# EAGLE design brain (EAGLE 7.5.0)
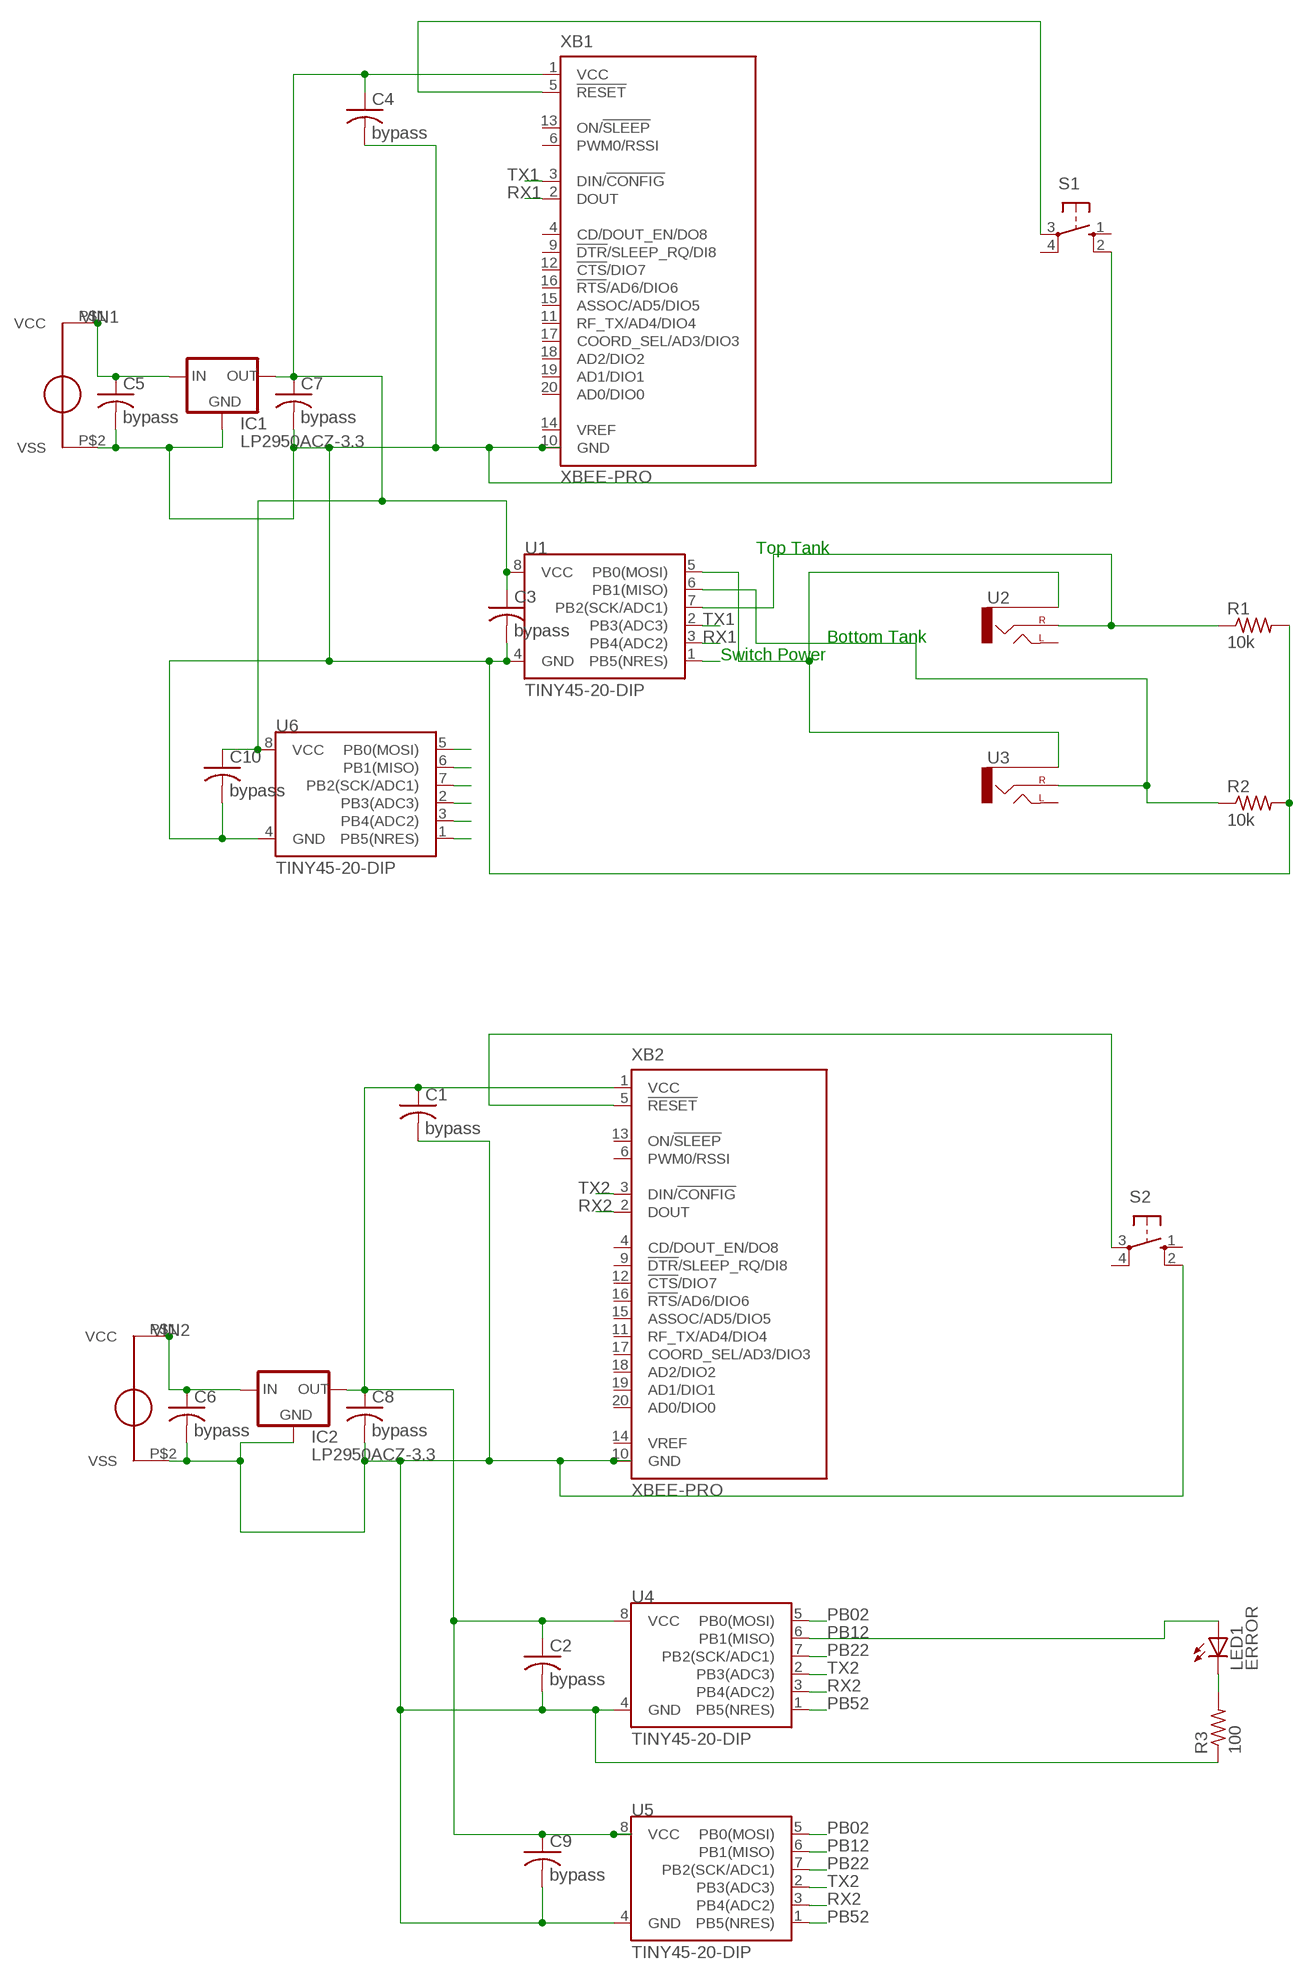
[diagram p0: schematic, sheet 1]

## Parts
C1  bypass  C-US050-025X075  [C050-025X075]
C2  bypass  C-US050-025X075  [C050-025X075]
C3  bypass  C-US050-025X075  [C050-025X075]
C4  bypass  C-US050-025X075  [C050-025X075]
C5  bypass  C-US050-025X075  [C050-025X075]
C6  bypass  C-US050-025X075  [C050-025X075]
C7  bypass  C-US050-025X075  [C050-025X075]
C8  bypass  C-US050-025X075  [C050-025X075]
C9  bypass  C-US050-025X075  [C050-025X075]
C10  bypass  C-US050-025X075  [C050-025X075]
IC1  LP2950ACZ-3.3  [TO92]
IC2  LP2950ACZ-3.3  [TO92]
LED1  ERROR  LED3MM  [LED3MM]
R1  10k  R-US_0207/10  [0207/10]
R2  10k  R-US_0207/10  [0207/10]
R3  100  R-US_0207/10  [0207/10]
S1  10-XX  [B3F-10XX]
S2  10-XX  [B3F-10XX]
U1  TINY45-20-DIP  ATTINY45TINY45-20-DIP  [DIP08]
U2  AUDIO-JACKPTH  [AUDIO-JACK]
U3  AUDIO-JACKPTH  [AUDIO-JACK]
U4  TINY45-20-DIP  ATTINY45TINY45-20-DIP  [DIP08]
U5  TINY45-20-DIP  ATTINY45TINY45-20-DIP  [DIP08]
U6  TINY45-20-DIP  ATTINY45TINY45-20-DIP  [DIP08]
U$3  SUNNYBUDDYMOUNT  [SUNNYBUDDYMOUNT]
U$6  SUNNYBUDDYMOUNT  [SUNNYBUDDYMOUNT]
XB1  XBEE-PRO  [XBEE-PRO]
XB2  XBEE-PRO  [XBEE-PRO]

## Nets
GND1: C3.2 C4.2 C5.2 C7.2 C10.2 IC1.2(GND) R1.2 R2.2 S1.2(S1) U1.4(GND) U6.4(GND) U$3.P$2(VSS) XB1.10(GND)
GND2: C1.2 C2.2 C6.2 C8.2 C9.2 IC2.2(GND) R3.1 S2.2(S1) U4.4(GND) U5.4(GND) U$6.P$2(VSS) XB2.10(GND)
N$5: LED1.K(C) R3.2
N$8: S2.3(P) XB2.5(!RESET)
N$13: S1.3(P) XB1.5(!RESET)
PB01: U1.5(PB0(MOSI)) U2.SLEEVE U3.SLEEVE U6.5(PB0(MOSI))
PB02: U4.5(PB0(MOSI)) U5.5(PB0(MOSI))
PB11: R2.1 U1.6(PB1(MISO)) U3.RING(RIGHT) U6.6(PB1(MISO))
PB12: LED1.A U4.6(PB1(MISO)) U5.6(PB1(MISO))
PB21: R1.1 U1.7(PB2(SCK/ADC1)) U2.RING(RIGHT) U6.7(PB2(SCK/ADC1))
PB22: U4.7(PB2(SCK/ADC1)) U5.7(PB2(SCK/ADC1))
PB51: U1.1(PB5(NRES)) U6.1(PB5(NRES))
PB52: U4.1(PB5(NRES)) U5.1(PB5(NRES))
RX1: U1.3(PB4(ADC2)) U6.3(PB4(ADC2)) XB1.2(DOUT)
RX2: U4.3(PB4(ADC2)) U5.3(PB4(ADC2)) XB2.2(DOUT)
TX1: U1.2(PB3(ADC3)) U6.2(PB3(ADC3)) XB1.3(DIN/!CONFIG)
TX2: U4.2(PB3(ADC3)) U5.2(PB3(ADC3)) XB2.3(DIN/!CONFIG)
VCC1: C3.1 C4.1 C7.1 C10.1 IC1.1(OUT) U1.8(VCC) U6.8(VCC) XB1.1(VCC)
VIN1: C5.1 IC1.3(IN) U$3.P$1(VCC)
VIN2: C6.1 IC2.3(IN) U$6.P$1(VCC)
VOUT2: C1.1 C2.1 C8.1 C9.1 IC2.1(OUT) U4.8(VCC) U5.8(VCC) XB2.1(VCC)
Unconnected: S1.1(S) S1.4(P1) S2.1(S) S2.4(P1) U2.TIP(LEFT) U3.TIP(LEFT) XB1.4(CD/DOUT_EN/DO8) XB1.6(PWM0/RSSI) XB1.9(!DTR!/SLEEP_RQ/DI8) XB1.11(RF_TX/AD4/DIO4) XB1.12(!CTS!/DIO7) XB1.13(ON/!SLEEP) XB1.14(VREF) XB1.15(ASSOC/AD5/DIO5) XB1.16(!RTS!/AD6/DIO6) XB1.17(COORD_SEL/AD3/DIO3) XB1.18(AD2/DIO2) XB1.19(AD1/DIO1) XB1.20(AD0/DIO0) XB2.4(CD/DOUT_EN/DO8) XB2.6(PWM0/RSSI) XB2.9(!DTR!/SLEEP_RQ/DI8) XB2.11(RF_TX/AD4/DIO4) XB2.12(!CTS!/DIO7) XB2.13(ON/!SLEEP) XB2.14(VREF) XB2.15(ASSOC/AD5/DIO5) XB2.16(!RTS!/AD6/DIO6) XB2.17(COORD_SEL/AD3/DIO3) XB2.18(AD2/DIO2) XB2.19(AD1/DIO1) XB2.20(AD0/DIO0)

## Notes on the sheet
- Top Tank
- Bottom Tank
- Switch Power

## Library data of the parts
C1-C10 = rcl:C-US: CAPACITOR, American symbol
IC1 IC2 = v-reg:LP2950?*: Source: http://cache.national.com/ds/LP/LP2950.pdf
LED1 = led:LED: LED OSRAM: - CHIPLED LG R971, LG N971, LY N971, LG Q971, LY Q971, LO R971, LY R971 LH N974, LH R974 LS Q976, LO Q976, LY Q976 LO Q996 - Hyper CHIPLED LW Q18S LB Q993, LB Q99A, LB R99A - SideLED LS A670, LO A670, LY A670, LG A670, LP A670 LB A673, LV A673, LT A673, LW A673 LH A674 LY A675 LS A676, LA A676, LO A676, LY A676, LW A676 LS A679, LY A679, LG A679 - Hyper Micro SIDELED® LS Y876, LA Y876, LO Y876, LY Y876 LT Y87S - SmartLED LW L88C, LW L88S LB L89C, LB L89S, LG L890 LS L89K, LO L89K, LY L89K LS L896, LA L896, LO L896, LY L896 - TOPLED LS T670, LO T670, LY T670, LG T670, LP T670 LSG T670, LSP T670, LSY T670, LOP T670, LYG T670 LG T671, LOG T671, LSG T671 LB T673, LV T673, LT T673, LW T673 LH T674 LS T676, LA T676, LO T676, LY T676, LB T676, LH T676, LSB T676, LW T676 LB T67C, LV T67C, LT T67C, LS T67K, LO T67K, LY T67K, LW E67C LS E67B, LA E67B, LO E67B, LY E67B, LB E67C, LV E67C, LT E67C LW T67C LS T679, LY T679, LG T679 LS T770, LO T770, LY T770, LG T770, LP T770 LB T773, LV T773, LT T773, LW T773 LH T774 LS E675, LA E675, LY E675, LS T675 LS T776, LA T776, LO T776, LY T776, LB T776 LHGB T686 LT T68C, LB T68C - Hyper Mini TOPLED® LB M676 - Mini TOPLED Santana® LG M470 LS M47K, LO M47K, LY M47K Source: http://www.osram.convergy.de LUXEON: - LUMILED® LXK2-PW12-R00, LXK2-PW12-S00, LXK2-PW14-U00, LXK2-PW14-V00 LXK2-PM12-R00, LXK2-PM12-S00, LXK2-PM14-U00 LXK2-PE12-Q00, LXK2-PE12-R00, LXK2-PE12-S00, LXK2-PE14-T00, LXK2-PE14-U00 LXK2-PB12-K00, LXK2-PB12-L00, LXK2-PB12-M00, LXK2-PB14-N00, LXK2-PB14-P00, LXK2-PB14-Q00 LXK2-PR12-L00, LXK2-PR12-M00, LXK2-PR14-Q00, LXK2-PR14-R00 LXK2-PD12-Q00, LXK2-PD12-R00, LXK2-PD12-S00 LXK2-PH12-R00, LXK2-PH12-S00 LXK2-PL12-P00, LXK2-PL12-Q00, LXK2-PL12-R00 Source: www.luxeon.com KINGBRIGHT: KA-3528ASYC Source: www.kingbright.com
R1-R3 = resistor:R-US_: RESISTOR, American symbol; MPN: LT3652EMSE#PBF; OC_NEWARK: 64R8539
S1 S2 = switch-omron:10-XX: OMRON SWITCH; MPN: B3F-1000; OC_FARNELL: 176432; OC_NEWARK: 36M3542
U1 U4-U6 = SparkFun-DigitalIC:ATTINY45: Atmel 8-pin 2/4/8kB flash uC; PROD_ID: IC-09439
U2 U3 = SparkFun-Connectors:AUDIO-JACK: 3.5mm Audio Jack Simple 3.5mm common PCB mount audio jack. SKU: PRT-08032
U$3 U$6 = seniordesign:SUNNYBUDDYMOUNT
XB1 XB2 = maxstream:XBEE: XBee (TM) /XBee-PRO(TM) OEM RF Modules Source: MaxStream, Inc. xbee_productmanual.pdf; OC_FARNELL: 1337916; OC_NEWARK: unknown

## Board
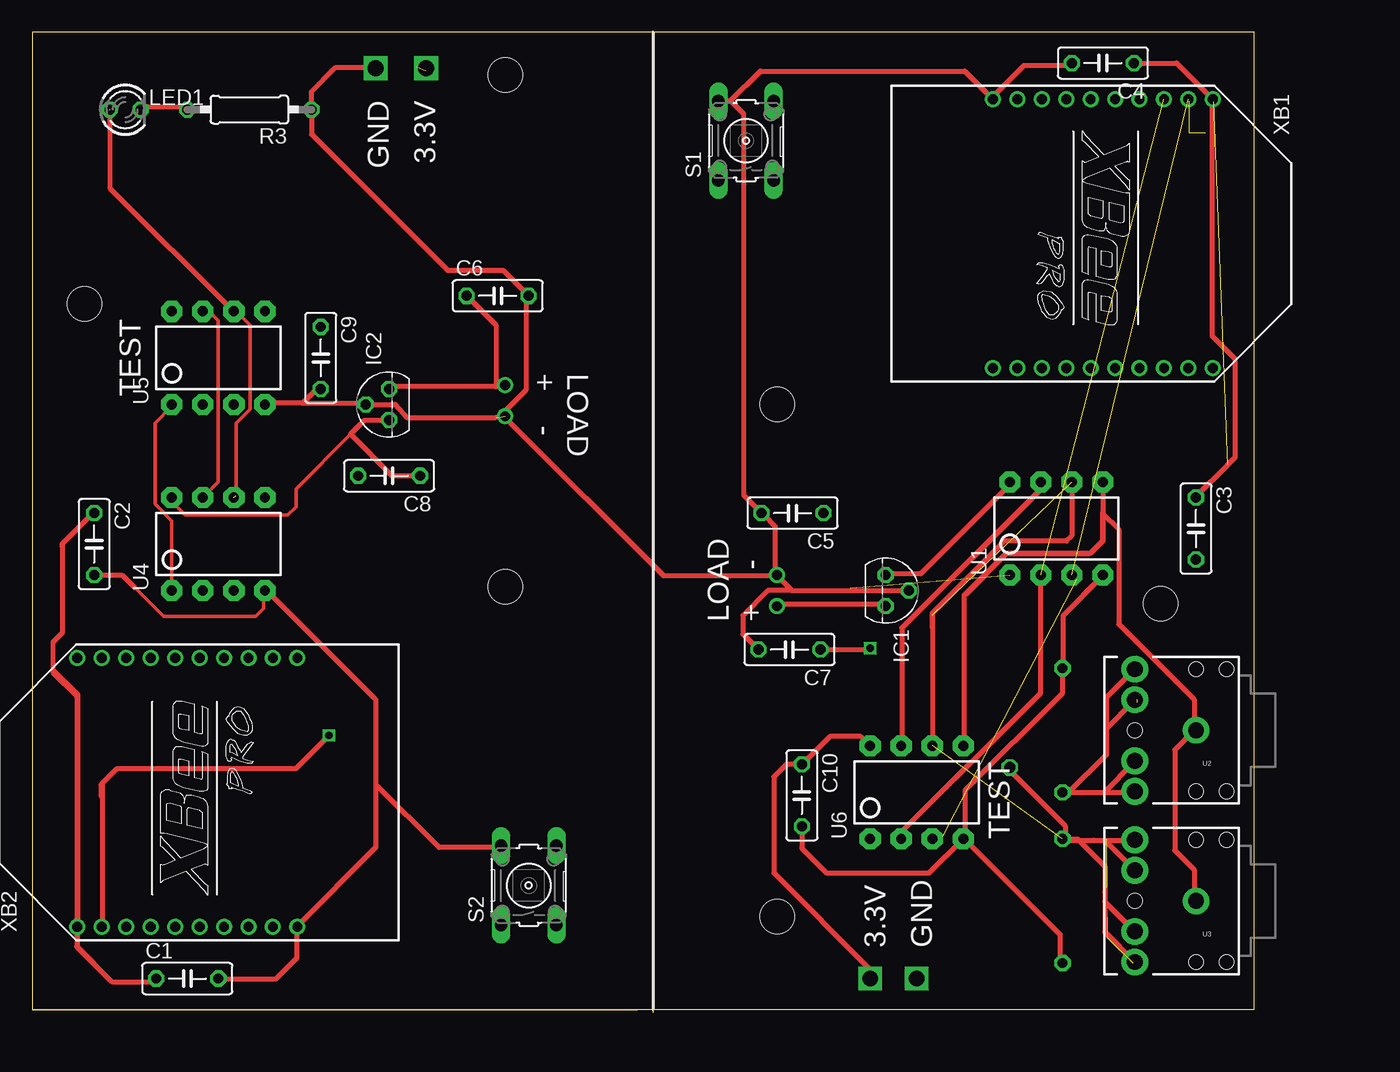
[diagram p1: board, top side]
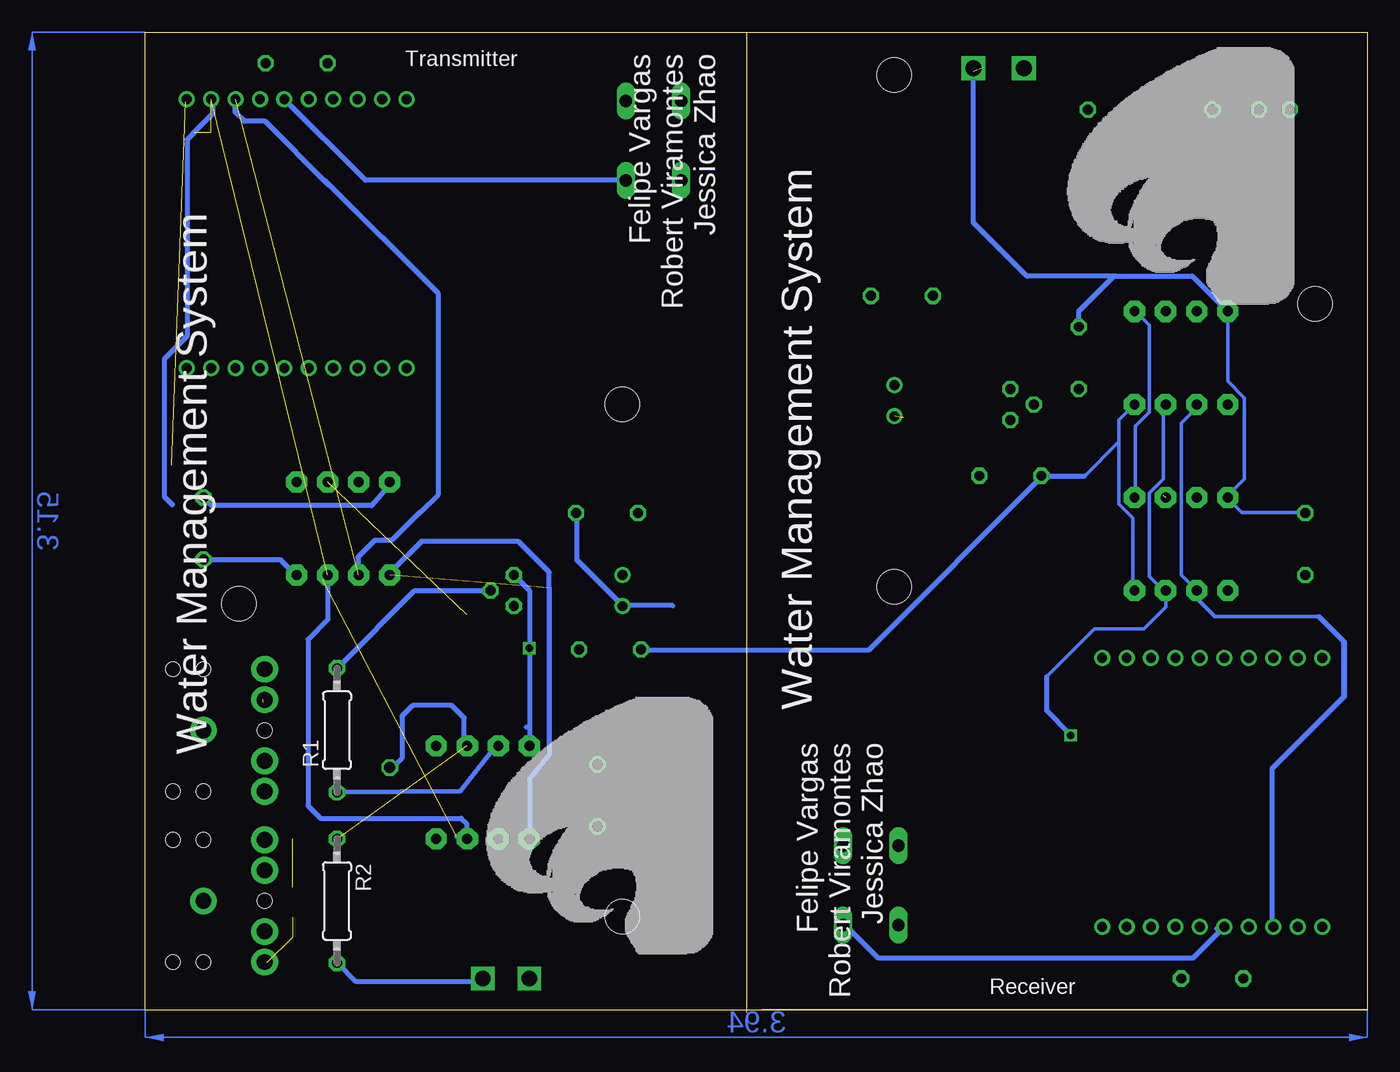
[diagram p2: board, bottom side, seen from below]

Size 100 x 80.25 mm. Coordinates in mm from the lower left corner, seen from the top.
Outline: 49.53,0.25 0,0.25 0,80.25 50.8,80.25
Outline: 100,0.25 100,80.25 50.8,80.25
Outline: 100,0.24 0,0.24
Outline: 50.8,80.25 50.8,0
Copper layers (1*16): Top 0.035mm / dielectric 1.5mm / Bottom 0.035mm
Design rules "default *": minimum track width 10mil, minimum drill 15mil, track to track 8mil, track to pad 8mil, pad to pad 8mil, via to via 8mil, smd to smd 8mil, copper to edge 40mil, drill to drill 8mil, minimum pad ring 10mil, minimum via ring 8mil, stop-mask expansion 4mil, vias tented up to drill 0mil, thermal gap 10mil
Holes 2.8 mm at 4.27,58.01 92.35,33.48

### Footprints (pad centres in the part's own frame; a part is rotated, then mirrored left to right if it is on the bottom)
C050-025X075 = drill 0.813 octagon: 1 -2.54,0; 2 2.54,0
TO92 = drill 0.813 octagon: 1 -1.27,0; 2 0,1.905; 3 1.27,0
LED3MM = drill 0.813 octagon: A -1.27,0; K 1.27,0
0207/10 = drill 0.813 octagon: 1 -5.08,0; 2 5.08,0
B3F-10XX = drill 1.016 long: 1 -3.251,2.261; 2 3.251,2.261; 3 -3.251,-2.261; 4 3.251,-2.261
DIP08 = drill 0.813 pad 1.727 octagon: 1 -3.81,-3.81; 2 -1.27,-3.81; 3 1.27,-3.81; 4 3.81,-3.81; 5 3.81,3.81; 6 1.27,3.81; 7 -1.27,3.81; 8 -3.81,3.81
AUDIO-JACK = drill 1.3 pad 2.184: RING 5,5; RSH 5,2.5; SLEEVE 0,0; TIP 5,-5; TSH 5,-2.5 | hole 1.2: 0,5; -2.5,5; -2.5,-5; 0,-5; 5,0
SUNNYBUDDYMOUNT = drill 0.8: P$1 1.27,-16.51; P$2 1.27,-13.97 | hole 2.8: 1.27,-41.91; 1.27,0
XBEE-PRO = drill 0.8 pad 1.27: 1 -11,9; 2 -11,7; 3 -11,5; 4 -11,3; 5 -11,1; 6 -11,-1; 7 -11,-3; 8 -11,-5; 9 -11,-7; 10 -11,-9; 11 11,-9; 12 11,-7; 13 11,-5; 14 11,-3; 15 11,-1; 16 11,1; 17 11,3; 18 11,5; 19 11,7; 20 11,9

### Placement (x,y rotation side)
C1  12.7,2.79 0 top
C2  5.08,38.35 270 top
C3  95.25,39.62 270 top
C4  87.63,77.72 180 top
C5  62.23,40.89 180 top
C6  38.1,58.67 0 top
C7  61.98,29.72 180 top
C8  29.21,43.94 180 top
C9  23.62,53.59 270 top
C10  62.99,17.78 270 top
IC1  69.85,34.54 270 top
IC2  29.21,49.78 90 top
LED1  7.62,73.91 0 top
R1  84.33,23.11 90 bottom
R2  84.33,9.14 270 bottom
R3  17.78,73.91 180 top
S1  58.42,71.37 90 top
S2  40.64,10.41 90 top
U1  83.82,39.62 0 top
U2  95.25,23.11 180 top
U3  95.25,9.14 180 top
U4  15.24,38.35 0 top
U5  15.24,53.59 0 top
U6  72.39,18.03 0 top
U$3  59.69,49.78 0 top
U$6  39.98,34.85 180 top
XB1  87.63,63.75 270 top
XB2  12.7,18.03 90 top

### Tracks (layer width: path | path; a pad name or v marks a point on that pad's centre or on a via)
GND1
  Top 0.406: C4.2 85.04,77.52 81.16,77.52 78.42,74.78 78.64,74.78 XB1.10 76.32,77.06 59.59,77.06 57.15,74.62 | 56.24,74.78 S1.2 57.15,74.62 | R2.2 84.12,4.14 84.12,6.43 76.35,14.2 U6.4 | 62.18,34.54 IC1.2 | 62.18,34.54 61.04,35.69 U$3.P$2 60.81,35.92 60.81,39.8 59.89,40.72 C5.2 58.22,42.37 58.22,73.56 57.15,74.62 | U1.4 87.55,35.69 84.35,32.49 84.35,28.37 R1.2 84.29,28.14 84.29,26.13 76.35,18.2 76.35,14.43 U6.4 | C10.2 62.99,13.46 65.02,11.43 73.41,11.43 U6.4 | 62.18,34.54 60.2,34.54 58.17,32.51 58.17,30.99 C7.2
  Bottom 0.406: C3.2 95.1,37.06 88.92,37.06 87.78,35.92 U1.4 | IC1.2 77.95,34.54 84.12,28.37 R1.2
GND2  (2 unrouted)
  Top 0.305: 22.1,49.86 19.2,49.86 U5.4 | 28.04,25.71 28.12,25.63 | 19.2,34.54 U4.4 18.96,34.46 18.96,33.1 18.29,32.42 10.75,32.42 8.38,34.79
  Top 0.406: S2.2 38.18,13.51 33.3,13.51 28.12,18.69 | 37.95,48.72 30.63,48.72 29.72,49.78 IC2.2 27.2,49.86 22.1,49.86 23.29,51.05 C9.2 | 38.18,48.72 40.46,51 40.46,58.55 C6.2 | 40.46,58.78 C6.2 | 28.12,25.63 28.12,18.69 | 28.12,18.69 28.12,13.51 21.72,7.11 XB2.10 21.67,7.01 21.67,4.49 19.98,2.79 C1.2 | C2.2 7.36,35.81 8.38,34.79 | 8.38,34.79 | 28.04,25.71 19.2,34.54 | 28.19,77.37 24.84,77.37 22.86,75.39 R3.1 22.86,71.88 33.98,60.76 38.56,60.76 C6.2
  Bottom 0.305: 20.34,46.74 20.34,48.49 U5.4 | 20.34,46.74 20.34,41.63 19.2,40.49 19.2,34.54 U4.4 | 23.14,43.94 20.34,46.74
  Bottom 0.406: C8.2 23.14,43.94
N$1  (1 unrouted)
N$2
  Bottom 0.406: 72.9,2.54 74.17,2.54
N$3  (2 unrouted)
N$4  (via drill 1.3)
  other vias: 72.39,2.79
N$5
  Top 0.406: LED1.K 8.91,74.09 12.57,74.09 R3.2
N$8
  Bottom 0.406: 12.34,6.88 11.89,6.88 XB2.5 14.25,4.49 40.04,4.49 42.67,7.11 42.75,7.11 S2.3
N$11
  Top 0.406: 2.46,38.27 2.46,38.35 5.08,40.97
N$12
  Top 0.406: 84.58,14.22 84.58,15.24 80.01,19.81
N$13
  Bottom 0.406: S1.3 82,68.12 XB1.5
N$14  (via drill 0.9)
  other vias: 80.01,20.07
N$15
  Bottom 0.406: 73.91,21.84 73.91,24.13 74.93,25.15 78.13,25.15 78.99,24.28 78.99,20.83 80.01,19.81
N$16  (1 unrouted)
N$17  (via drill 1.3)
  other vias: 32.23,77.29
N$18
  Top 0.406: 87.62,40.97 87.62,38.6 86.61,37.59 79.75,37.59 76.36,34.2
N$19
  Bottom 0.406: 72.69,2.54 82.75,2.54 84.28,4.06
N$20  (1 unrouted)
  Bottom 0.406: 20.57,60.28 27.85,60.28 32.26,64.68 32.26,77.04
N$21
  Top 0.406: 85.08,43.34 85.08,39.03 84.66,38.6 79.58,38.6 73.65,32.68 73.65,31.49
N$22
  Top 0.406: 82.54,43.18 82.54,42.84 71.2,31.49 71.2,21.93
N$23
  Bottom 0.406: 85.08,35.64 85.08,32.17 86.69,30.56 86.69,16.93 85.67,15.92 74.16,15.92 73.74,15.49 73.74,14.31
N$24
  Bottom 0.406: 80,35.98 77.38,38.6 69.5,38.6 67.05,36.15
N$25
  Bottom 0.406: 66.97,34.71 66.97,36.06 67.64,36.74
N$26
  Bottom 0.406: 77.55,40.89 | 77.55,40.89 76.02,42.41 76.02,58.84 85.25,68.07
N$27
  Top 0.406: 97.86,44.87 | 97.86,44.87 98.46,45.46 98.46,53.5 96.59,55.37 96.59,74.58 96.68,74.67
N$28  (2 unrouted)
  Bottom 0.406: 96,72.04 96.59,71.45 96.59,55.37 98.46,53.5 98.46,42.24 97.78,41.57
N$29
  Top 0.406: 10.24,2.79 9.99,2.54 6.52,2.54 3.64,5.42 3.64,6.94 3.64,7.11 3.64,26.08
N$30
  Top 0.406: 15.41,2.88 15.24,2.71
N$31
  Top 0.406: 5.67,17.69 5.67,18.71 6.94,19.98 21.59,19.98 24.38,22.77
N$32
  Bottom 0.305: 26.24,27.51 22.35,31.41 18.29,31.41 16.51,33.19 16.51,34.54
  Bottom 0.406: 24.3,22.69 24.3,22.77 26.24,24.72 26.24,27.51
N$33
  Bottom 0.305: 3.98,32.42 12.53,32.42 14.05,33.95 14.05,34.46
  Bottom 0.406: 1.95,25.91 1.95,30.39 3.98,32.42
N$34
  Top 0.406: 2.46,38.18 2.46,31.07 1.69,30.31 1.69,27.85 3.64,25.91
N$35
  Top 0.305: 8.38,34.79 10.75,32.42 18.29,32.42 18.96,33.1 18.96,34.46
N$36
  Top 0.406: 19.05,49.94 22.25,49.94
N$37
  Bottom 0.406: 85.04,67.77 90.22,72.95 91.9,72.95 92.66,73.71 92.66,74.62
N$38
  Bottom 0.406: 77.57,40.95 79.86,38.66 81.23,38.66 82.6,37.29 82.6,35.92 82.45,35.76
N$39
  Bottom 0.406: 94.49,74.78 94.49,73.56 96.16,71.88
N$40
  Top 0.406: 84.43,14.12 86.87,14.12 87.78,14.12 | 87.78,14.12 90.22,14.12 | 87.78,14.12 90.22,11.68
N$41
  Top 0.406: 87.78,18.09 90.22,20.52
N$42
  Top 0.406: 84.58,17.93 84.73,17.93 87.94,21.13 87.94,22.35 87.94,23.27 | 87.94,23.27 87.94,25.86 90.07,27.99 | 87.94,23.27 90.22,25.55
N$43
  Top 0.406: 38.86,48.56 51.66,35.76 61.27,35.76
N$44
  Bottom 0.406: 56.84,33.32 60.81,33.32
N$45
  Bottom 0.406: 26.52,43.99 40.84,29.67 59.44,29.67
PB01
  Top 0.406: 95.1,23.11 93.5,21.51 93.5,13.28 95.1,11.68 95.1,9.17 U3.SLEEVE | U6.5 76.27,21.97 76.27,34.16 79.7,37.59 86.56,37.59 87.63,38.66 87.63,40.87 | 95.1,23.11 95.1,25.63 88.92,31.8 88.92,39.57 87.63,40.87 | 95.1,23.11 U2.SLEEVE | U1.5 87.63,41.4 87.63,40.87
PB02
  Bottom 0.305: U4.5 18.97,42.32 18.97,48.03 17.83,49.17 17.83,56.26 18.97,57.4 U5.5
PB11  (2 unrouted)
  Top 0.406: U6.6 73.67,21.89 73.67,32.45 73.68,32.54 | R2.1 85.55,14.22 87.78,11.99 87.78,9.86 87.78,9.09 | 87.78,9.09 87.78,6.61 U3.RING | 87.78,9.09 90.37,6.5
PB12  (2 unrouted)
  Top 0.305: 16.46,57.4 U5.6 16.69,57.4 17.83,56.26 17.83,49.4 16.69,48.26 16.69,42.32
  Top 0.406: 6.4,73.86 6.4,67.46 16.46,57.4
PB21
  Top 0.406: U1.7 82.55,42.88 71.17,31.5 71.17,21.89 U6.7 | R1.1 90.17,18.03 U2.RING
  Bottom 0.406: U6.7 71.32,21.74 71.67,21.4 74.23,18.17 84.12,18.09 R1.1
PB22
  Top 0.305: U5.7 14.48,57.4 15.24,56.64 15.24,43.43 U4.7
PB51  (1 unrouted)
  Bottom 0.406: U6.1 68.58,19.13 66.95,21.09 66.95,34.77 | 80.01,35.92 U1.1
PB52
  Top 0.305: U4.1 11.43,40.26 10.06,41.63 10.06,48.26 11.43,49.63 U5.1
RX1  (2 unrouted)
  Bottom 0.406: 74.52,14.43 73.84,14.43 U6.3 | 85.5,35.46 85.27,35.69 U1.3
RX2  (via drill 0.6)
  Top 0.406: XB2.2 5.71,7.11 5.71,18.75 6.94,19.98 21.59,19.98 v24.3,22.69
  Bottom 0.305: U5.3 16.69,49.63 16.69,43.69 17.83,42.54 17.83,35.69 16.69,34.54 U4.3 16.51,33.19 18.29,31.41 22.35,31.41 26.24,27.51
  Bottom 0.406: v24.3,22.69 24.3,22.77 26.24,24.72 26.24,27.51
TX1  (1 unrouted)
  Top 0.406: U6.2 71.32,14.43 71.32,14.94 82.53,26.14 82.53,35.69 U1.2
TX2
  Bottom 0.305: U4.2 13.72,34.54 | 14.17,34.54 U4.2 | U5.2 13.97,49.53 15.24,48.26 15.24,35.81 U4.2 | 3.98,32.42 12.45,32.42 13.97,33.95 U4.2
  Bottom 0.406: XB2.3 7.77,7.11 7.77,20 1.86,25.91 1.86,30.31 3.98,32.42
VCC1  (via drill 0.6, 1.3)  (1 unrouted)
  Top 0.406: IC1.1 69.95,35.92 72.69,35.92 80.01,43.23 U1.8 | 97.84,44.83 95.33,42.32 C3.1 | 96.7,74.55 XB1.1 93.66,77.72 C4.1 | U6.8 67.82,22.61 65.28,22.61 C10.1 61.72,20.32 60.71,19.3 60.71,11.43 68.58,3.56 v68.58,2.79 | C7.1 68.48,29.72 v68.58,29.82
  Bottom 0.406: C3.1 94.59,41.49 81.49,41.49 80.01,43.23 U1.8 | 68.58,23.37 v68.58,29.82 68.58,34.54 IC1.1 | 68.58,23.37 U6.8 | 68.58,23.37 68.83,23.37
VCC2  (via drill 1.3)
  other vias: 28.11,77.29
VIN1
  Top 0.406: U$3.P$1 61.04,33.4 69.72,33.4 IC1.3
  Bottom 0.406: C5.1 64.69,40.72 64.69,37.06 61.04,33.4 U$3.P$1
VIN2
  Top 0.406: 37.95,51.23 37.95,56.26 35.66,58.55 C6.1 | 37.95,51.23 29.26,51.23 IC2.3 | 37.95,51.23 U$6.P$1
VOUT2
  Top 0.305: U4.8 11.43,41.82 12.53,40.72 20.91,40.72 21.59,41.4 21.59,42.87 26.06,47.35
  Top 0.406: IC2.1 29.03,48.49 27.2,48.49 26.39,47.68 26.06,47.35 29.46,43.94 C8.1 | C2.1 5,40.89 2.46,38.35 2.46,31.07 1.69,30.31 1.69,28.11 3.73,26.08 3.73,7.06 XB2.1 3.7,5.36 6.52,2.54 9.91,2.54 C1.1
  Bottom 0.305: 5.26,40.95 10.29,40.95 11.43,42.09 U4.8 11.43,42.32 10.06,43.69 10.06,50.32 11.43,51.69 U5.8 11.58,57.56 14.22,60.2 20.83,60.2
  Bottom 0.406: 5.26,40.95 C2.1 | C9.1 23.62,57.4 20.83,60.2 | 20.73,60.3 14.33,60.3 11.58,57.56
(copper drawn outside any net)
  shapes: Bottom area x2

### Text on the board
tPlace: GND | 3.3V | LOAD / + - | TEST | LOAD / + - | TEST | 3.3V | GND
bPlace: Felipe Vargas / Robert Viramontes / Jessica Zhao | Transmitter | Water Management System | Water Management System | Felipe Vargas / Robert Viramontes / Jessica Zhao | Receiver